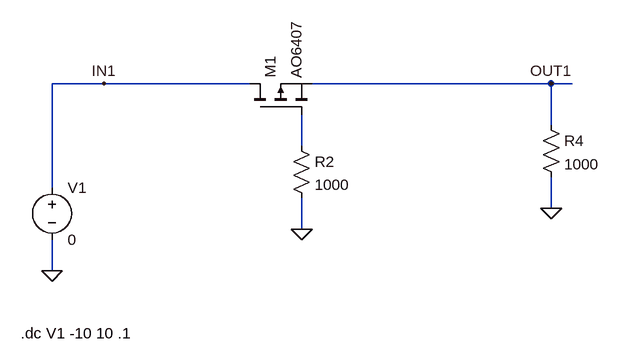
[diagram p0: schematic RVP.asc]
RVP.asc, the LTspice schematic file:
Version 4
SHEET 1 880 680
WIRE -48 0 -128 0
WIRE 176 0 -48 0
WIRE 640 0 272 0
WIRE 672 0 640 0
WIRE 640 64 640 0
WIRE 256 96 256 48
WIRE -128 160 -128 0
WIRE 640 192 640 144
WIRE 256 224 256 176
WIRE -128 288 -128 240
FLAG -128 288 0
FLAG 640 0 OUT1
FLAG 256 224 0
FLAG 640 192 0
FLAG -48 0 IN1
SYMBOL voltage -128 144 R0
WINDOW 123 0 0 Left 2
WINDOW 39 0 0 Left 2
SYMATTR InstName V1
SYMATTR Value 0
SYMBOL pmos 176 48 R270
SYMATTR InstName M1
SYMATTR Value AO6407
SYMBOL res 240 80 R0
SYMATTR InstName R2
SYMATTR Value 1000
SYMBOL res 624 48 R0
SYMATTR InstName R4
SYMATTR Value 1000
TEXT -176 384 Left 2 !.dc V1 -10 10 .1

The netlist it stands for:
* RVP.asc
V1 IN1 0 0
M1 IN1 N001 OUT1 OUT1 AO6407
R2 N001 0 1000
R4 OUT1 0 1000
.model NMOS NMOS
.model PMOS PMOS
.lib standard.mos
.dc V1 -10 10 .1
.backanno
.end